# EAGLE schematic Capacitacion_SMD (EAGLE 6.4)
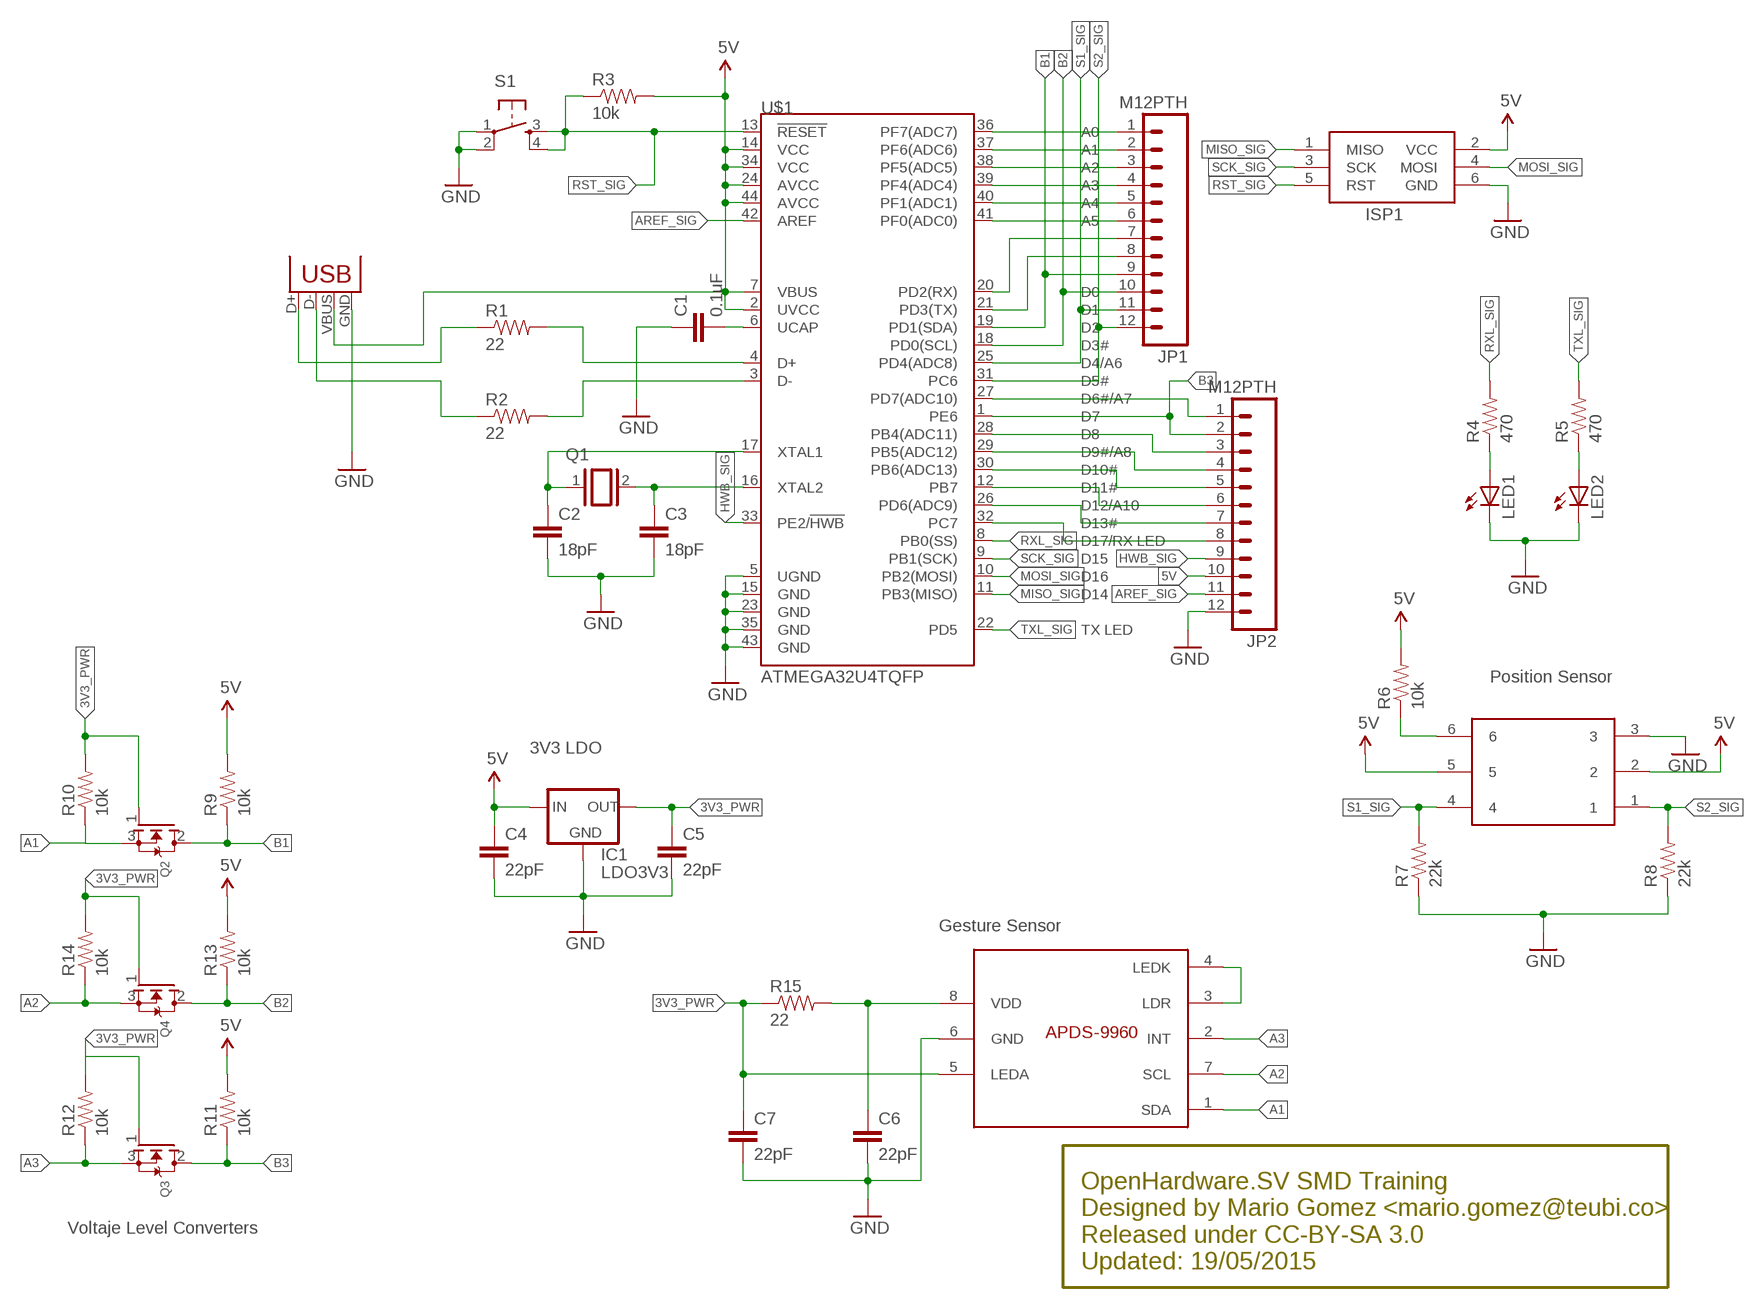
[diagram p0: schematic, sheet 1]

## Parts
C1  0.1uF  0.1UF-50V-20%(PTH)KIT-EZ  [CAP-PTH-SMALL-KIT]
C2  18pF  0.1UF-50V-20%(PTH)KIT-EZ  [CAP-PTH-SMALL-KIT]
C3  18pF  0.1UF-50V-20%(PTH)KIT-EZ  [CAP-PTH-SMALL-KIT]
C4  22pF  0.1UF-50V-20%(PTH)KIT-EZ  [CAP-PTH-SMALL-KIT]
C5  22pF  0.1UF-50V-20%(PTH)KIT-EZ  [CAP-PTH-SMALL-KIT]
C6  22pF  0.1UF-50V-20%(PTH)KIT-EZ  [CAP-PTH-SMALL-KIT]
C7  22pF  0.1UF-50V-20%(PTH)KIT-EZ  [CAP-PTH-SMALL-KIT]
IC1  LDO3V3  78XXL  [78XXL]
ISP1  AVRISP-6  [AVRISP]
JP1  M12PTH  [1X12]
JP2  M12PTH  [1X12]
LED1  LED5MM  [LED5MM]
LED2  LED5MM  [LED5MM]
Q1  XTAL/S  [QS]
Q2  MOSFET-NGDS_TO220V  [TO220V]
Q3  MOSFET-NGDS_TO220V  [TO220V]
Q4  MOSFET-NGDS_TO220V  [TO220V]
R1  22  RESISTORAXIAL-0.3  [AXIAL-0.3]
R2  22  RESISTORAXIAL-0.3  [AXIAL-0.3]
R3  10k  RESISTORAXIAL-0.3  [AXIAL-0.3]
R4  470  RESISTORAXIAL-0.3  [AXIAL-0.3]
R5  470  RESISTORAXIAL-0.3  [AXIAL-0.3]
R6  10k  RESISTORAXIAL-0.3  [AXIAL-0.3]
R7  22k  RESISTORAXIAL-0.3  [AXIAL-0.3]
R8  22k  RESISTORAXIAL-0.3  [AXIAL-0.3]
R9  10k  RESISTORAXIAL-0.3  [AXIAL-0.3]
R10  10k  RESISTORAXIAL-0.3  [AXIAL-0.3]
R11  10k  RESISTORAXIAL-0.3  [AXIAL-0.3]
R12  10k  RESISTORAXIAL-0.3  [AXIAL-0.3]
R13  10k  RESISTORAXIAL-0.3  [AXIAL-0.3]
R14  10k  RESISTORAXIAL-0.3  [AXIAL-0.3]
R15  22  RESISTORAXIAL-0.3  [AXIAL-0.3]
S1  TAC_SWITCHPTH  [TACTILE-PTH]
U$1  ATMEGA32U4TQFP  [SPARKFUN-DIGITALIC_TQFP44]
U$2  USBPTH  [USB-B-PTH]
U$3  RPI-1031  [RPI-1031]
U$4  APDS-9960  [APDS-9960]

## Nets
3V3_PWR: C5.1 C7.1 IC1.OUT Q2.1(G) Q3.1(G) Q4.1(G) R10.P$2 R12.P$2 R14.P$2 R15.P$1 U$4.5(LEDA)
5V: C4.1 IC1.IN ISP1.2(VCC) JP2.10 R3.P$2 R6.P$2 R9.P$2 R11.P$2 R13.P$2 U$1.2(UVCC) U$1.7(VBUS) U$1.14(VCC) U$1.24(AVCC) U$1.34(VCC) U$1.44(AVCC) U$2.VBUS U$3.2 U$3.5
A1: Q2.3(S) R10.P$1 U$4.1(SDA)
A2: Q4.3(S) R14.P$1 U$4.7(SCL)
A3: Q3.3(S) R12.P$1 U$4.2(INT)
AREF_SIG: JP2.11 U$1.42(AREF)
B1: JP1.9 Q2.2(D) R9.P$1 U$1.19(PD1(SDA))
B2: JP1.10 Q4.2(D) R13.P$1 U$1.18(PD0(SCL))
B3: JP2.2 Q3.2(D) R11.P$1 U$1.1(PE6)
GND: C1.1 C2.2 C3.2 C4.2 C5.2 C6.2 C7.2 IC1.GND ISP1.6(GND) JP2.12 LED1.K(C) LED2.K(C) R7.P$1 R8.P$1 S1.1 S1.2 U$1.5(UGND) U$1.15(GND) U$1.23(GND) U$1.35(GND) U$1.43(GND) U$2.GND U$3.3 U$4.6(GND)
HWB_SIG: JP2.9 U$1.33(PE2/!HWB)
MISO_SIG: ISP1.1(MISO) U$1.11(PB3(MISO))
MOSI_SIG: ISP1.4(MOSI) U$1.10(PB2(MOSI))
N$1: R2.P$2 U$1.3(D-)
N$2: R1.P$2 U$1.4(D+)
N$3: R1.P$1 U$2.D+
N$4: R2.P$1 U$2.D-
N$5: JP2.1 U$1.27(PD7(ADC10))
N$6: C1.2 U$1.6(UCAP)
N$7: C3.1 Q1.2 U$1.16(XTAL2)
N$8: C2.1 Q1.1 U$1.17(XTAL1)
N$10: JP2.3 U$1.28(PB4(ADC11))
N$11: LED1.A R4.P$1
N$12: LED2.A R5.P$1
N$13: JP1.1 U$1.36(PF7(ADC7))
N$14: JP1.2 U$1.37(PF6(ADC6))
N$15: JP1.3 U$1.38(PF5(ADC5))
N$16: JP1.4 U$1.39(PF4(ADC4))
N$17: JP1.5 U$1.40(PF1(ADC1))
N$18: JP1.6 U$1.41(PF0(ADC0))
N$19: JP1.7 U$1.20(PD2(RX))
N$20: JP1.8 U$1.21(PD3(TX))
N$25: JP2.4 U$1.29(PB5(ADC12))
N$26: JP2.5 U$1.30(PB6(ADC13))
N$27: JP2.6 U$1.12(PB7)
N$28: JP2.7 U$1.26(PD6(ADC9))
N$29: JP2.8 U$1.32(PC7)
N$30: R6.P$1 U$3.6
N$31: U$4.3(LDR) U$4.4(LEDK)
N$32: C6.1 R15.P$2 U$4.8(VDD)
RST_SIG: ISP1.5(RST) R3.P$1 S1.3 S1.4 U$1.13(!RESET)
RXL_SIG: R4.P$2 U$1.8(PB0(SS))
S1_SIG: JP1.11 R7.P$2 U$1.25(PD4(ADC8)) U$3.4
S2_SIG: JP1.12 R8.P$2 U$1.31(PC6) U$3.1
SCK_SIG: ISP1.3(SCK) U$1.9(PB1(SCK))
TXL_SIG: R5.P$2 U$1.22(PD5)

## Notes on the sheet
- Position Sensor
- 3V3 LDO
- Gesture Sensor
- Voltaje Level Converters
- OpenHardware.SV SMD Training
  Designed by Mario Gomez <mario.gomez@teubi.co>
  Released under CC-BY-SA 3.0
  Updated: 19/05/2015

## Library data of the parts
C1-C7 = SparkFun-Capacitors:0.1UF-50V-20%(PTH): CAP-08370; PROD_ID: CAP-08370
IC1 = v-reg:78XXL: VOLTAGE REGULATOR
ISP1 = adafruit:AVRISP: AVR ISP HEADER Standard 6 pin header for AVR programming
JP1 JP2 = SparkFun-Connectors:M12: Header 12 Standard 12-pin 0.1" header. Use with straight break away headers (SKU : PRT-00116), right angle break away headers (PRT-00553), swiss pins (PRT-00743), machine pins (PRT-00117), and female headers (PRT-00115).
LED1 LED2 = SparkFun-LED:LED: LEDs Standard schematic elements and footprints for 5mm, 3mm, 1206, and 0603 sized LEDs. 5mm - Spark Fun Electronics SKU : COM-00529 (and others)
Q1 = special:XTAL/S: CRYSTAL
Q2-Q4 = adafruit:MOSFET-N: N-Channel Mosfet 2N7002E - 60V 260mA SOT23 [Digikey: 2N7002ET1GOSTR-ND] - REEL BSH103 - 30V 850mA SOT23 [Digikey: 568-5013-1-ND]
R1-R15 = SparkFun-Resistors:RESISTOR: Resistor Basic schematic elements and footprints for 0603, 1206, and PTH resistors.
S1 = SparkFun-Electromechanical:TAC_SWITCH: Momentary Switch Button commonly used for reset or general input. Spark Fun Electronics SKU : COM-00097 SMT- SWCH-08247
U$1 = SparkFun-DigitalIC:ATMEGA32U4: Atmel 44-pin 8-bit Microcontroller with 32KBytes of ISP Flash and USB Controller ----- Please use the QFN-44-NOPAD_1:1 package for the footprint of all boards using a 32U4. Route traces directly away from the pads as much as possible.
U$2 = SparkFun-Connectors:USB: USB Connectors USB-B-PTH is fully proven SKU : PRT-00139/CONN-08278 USB-miniB is fully proven SKU : PRT-00587 USB-A-PCB is untested. USB-A-H is throughly reviewed, but untested. Spark Fun Electronics SKU : PRT-00437 USB-B-SMT is throughly reviewed, but untested. Needs silkscreen touching up. USB-A-S has not been used/tested USB-MB-H has not been used/tested USB-MICROB has been used. CONN-09505; PROD_ID: CONN-08278; VALUE: USB-B
U$3 = custom_components:RPI-1031
U$4 = custom_components:APDS-9960